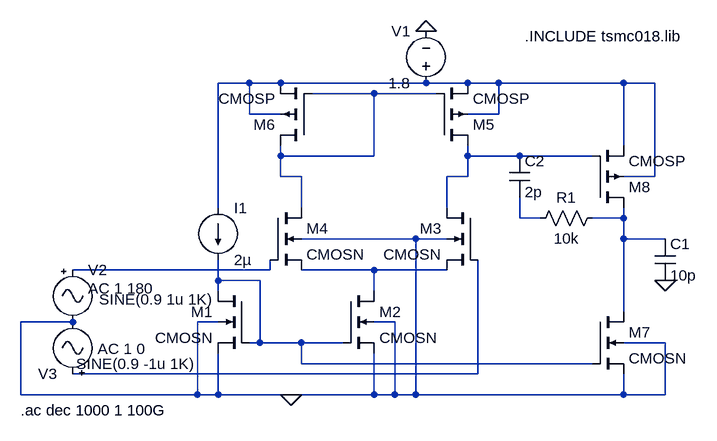
[diagram p0: schematic open_loop_modified 1.asc]
open_loop_modified 1.asc, the LTspice schematic file:
Version 4
SHEET 1 1916 680
WIRE -16 -160 -64 -160
WIRE 32 -160 -16 -160
WIRE 256 -160 32 -160
WIRE 320 -160 256 -160
WIRE 368 -160 320 -160
WIRE 560 -160 368 -160
WIRE 608 -160 560 -160
WIRE 176 -144 80 -144
WIRE 272 -144 176 -144
WIRE -16 -112 -16 -160
WIRE 32 -112 -16 -112
WIRE 368 -112 368 -160
WIRE 368 -112 320 -112
WIRE 560 -64 560 -160
WIRE 32 -48 32 -64
WIRE 176 -48 176 -144
WIRE 176 -48 32 -48
WIRE 320 -48 320 -64
WIRE 400 -48 320 -48
WIRE 512 -48 400 -48
WIRE 32 -16 32 -48
WIRE 64 -16 32 -16
WIRE 320 -16 320 -48
WIRE 320 -16 288 -16
WIRE 608 -16 608 -160
WIRE 608 -16 560 -16
WIRE -64 32 -64 -160
WIRE 64 32 64 -16
WIRE 288 32 288 -16
WIRE 400 48 400 16
WIRE 432 48 400 48
WIRE 560 48 560 32
WIRE 560 48 512 48
WIRE 240 80 64 80
WIRE 288 80 240 80
WIRE 560 80 560 48
WIRE 624 80 560 80
WIRE 16 128 16 112
WIRE 16 128 -288 128
WIRE 176 128 64 128
WIRE 288 128 176 128
WIRE -64 144 -64 112
WIRE 0 144 -64 144
WIRE -64 160 -64 144
WIRE 176 160 176 128
WIRE 560 192 560 80
WIRE -288 208 -368 208
WIRE -64 208 -96 208
WIRE 208 208 176 208
WIRE 0 240 0 144
WIRE 0 240 -16 240
WIRE 64 240 0 240
WIRE 128 240 64 240
WIRE 624 240 560 240
WIRE 64 272 64 240
WIRE 512 272 64 272
WIRE 336 288 336 112
WIRE 336 288 -288 288
WIRE -368 320 -368 208
WIRE -96 320 -96 208
WIRE -96 320 -368 320
WIRE -64 320 -64 256
WIRE -64 320 -96 320
WIRE 48 320 -64 320
WIRE 176 320 176 256
WIRE 176 320 48 320
WIRE 208 320 208 208
WIRE 208 320 176 320
WIRE 240 320 240 80
WIRE 240 320 208 320
WIRE 560 320 560 288
WIRE 560 320 240 320
WIRE 624 320 624 240
WIRE 624 320 560 320
FLAG 256 -240 0
FLAG 48 320 0
FLAG 624 144 0
SYMBOL cmosn -16 160 M0
SYMATTR InstName M1
SYMATTR Value2 l=1u w=2u
SYMBOL cmosn 128 160 R0
SYMATTR InstName M2
SYMATTR Value2 l=1u w=20u
SYMBOL cmosn 336 32 M0
SYMATTR InstName M3
SYMATTR Value2 l=1u w=2.1739u
SYMBOL cmosn 16 32 R0
SYMATTR InstName M4
SYMATTR Value2 l=1u w=2.1739u
SYMBOL cmosp 272 -64 M180
SYMATTR InstName M5
SYMATTR Value2 l=1u w=1.189u
SYMBOL cmosp 80 -64 R180
SYMATTR InstName M6
SYMATTR Value2 l=1u w=1.189u
SYMBOL current -64 32 R0
WINDOW 123 0 0 Left 2
WINDOW 39 0 0 Left 2
SYMATTR InstName I1
SYMATTR Value 2µ
SYMBOL voltage 256 -144 R180
WINDOW 0 24 96 Left 2
WINDOW 3 24 16 Left 2
WINDOW 123 0 0 Left 2
WINDOW 39 0 0 Left 2
SYMATTR InstName V1
SYMATTR Value 1.8
SYMBOL Misc\\signal -288 112 R0
WINDOW 3 41 61 Left 2
WINDOW 123 24 44 Left 2
WINDOW 39 0 0 Left 2
SYMATTR Value SINE(0.9 1u 1K)
SYMATTR Value2 AC 1 180
SYMATTR InstName V2
SYMBOL Misc\\signal -288 304 R180
WINDOW 3 -189 32 Left 2
WINDOW 123 -112 55 Left 2
WINDOW 39 0 0 Left 2
SYMATTR Value SINE(0.9 -1u 1K)
SYMATTR Value2 AC 1 0
SYMATTR InstName V3
SYMBOL cmosn 512 192 R0
SYMATTR InstName M7
SYMATTR Value2 l=1u w=100u
SYMBOL cmosp 512 32 M180
SYMATTR InstName M8
SYMATTR Value2 l=1u w=11.89u
SYMBOL cap 608 80 R0
SYMATTR InstName C1
SYMATTR Value 10p
SYMBOL cap 384 -48 R0
SYMATTR InstName C2
SYMATTR Value 2p
SYMBOL res 528 32 R90
WINDOW 0 0 56 VBottom 2
WINDOW 3 32 56 VTop 2
SYMATTR InstName R1
SYMATTR Value 10k
TEXT 408 -232 Left 2 !.INCLUDE tsmc018.lib
TEXT -368 344 Left 2 !.ac dec 1000 1 100G

The netlist it stands for:
* open_loop_modified 1.asc
M1 N008 N008 0 0 CMOSN l=1u w=2u
M2 N007 N008 0 0 CMOSN l=1u w=20u
M3 N003 N009 N007 0 CMOSN l=1u w=2.1739u
M4 N002 N006 N007 0 CMOSN l=1u w=2.1739u
M5 N003 N002 N001 N001 CMOSP l=1u w=1.189u
M6 N002 N002 N001 N001 CMOSP l=1u w=1.189u
I1 N001 N008 2µ
V1 N001 0 1.8
V2 N006 0 SINE(0.9 1u 1K) AC 1 180
V3 N009 0 SINE(0.9 -1u 1K) AC 1 0
M7 N005 N008 0 0 CMOSN l=1u w=100u
M8 N005 N003 N001 N001 CMOSP l=1u w=11.89u
C1 N005 0 10p
C2 N003 N004 2p
R1 N005 N004 10k
.model NMOS NMOS
.model PMOS PMOS
.lib standard.mos
.INCLUDE tsmc018.lib
.ac dec 1000 1 100G
.backanno
.end